# EasyEDA Pro project Motor_main.eprj

# Schematic MOTOR_MAIN_SCH
Board Name: MOTOR_MAIN_C8T6; Create Date: 2026-03-21; Page Name: P1; Project Name: Motor_main; Schematic Name: MOTOR_MAIN_SCH; Update Date: 2026-03-28; Company: EasyEDA.com; Drawn: DatPt; Page Size: A4; Version: V1.0
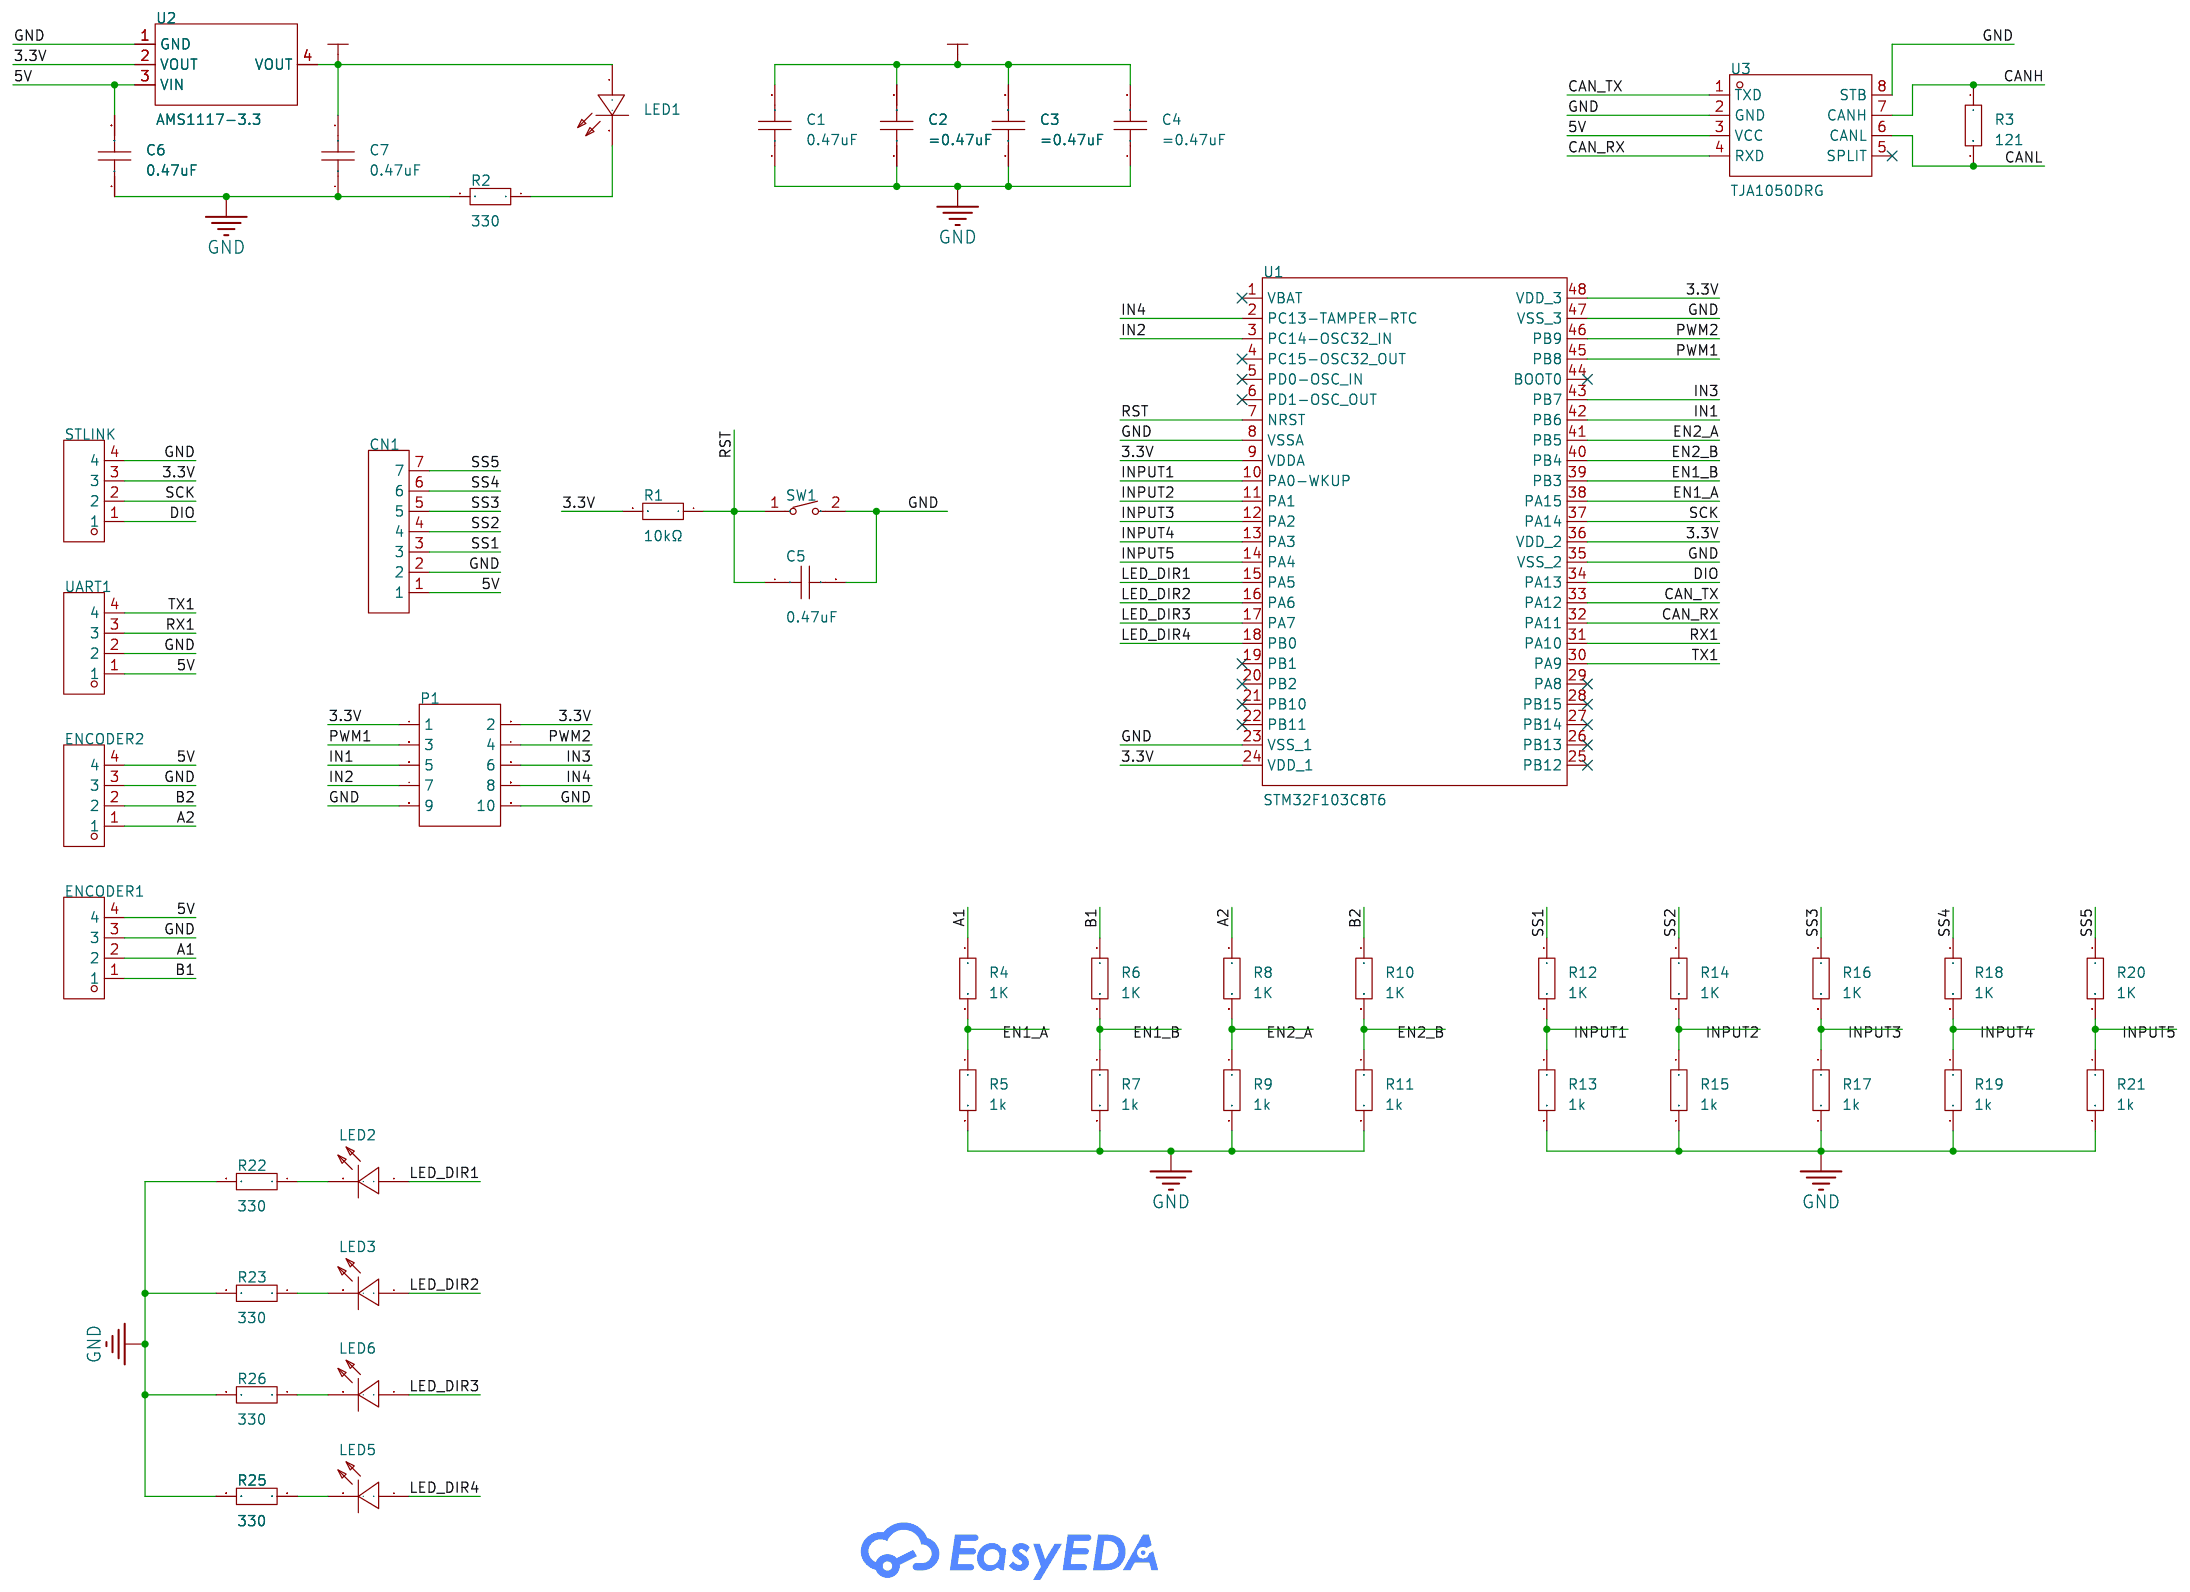
[diagram p0: schematic sheet]

## Parts
C1  0.47uF  [C0805]
C2  100nF  [C0805]
C3  100nF  [C0805]
C4  100nF  [C0805]
C5  0.47uF  [C0805]
C6  0.47uF  [C0805]
C7  0.47uF  [C0805]
CN1  WAFER-XH254Z-7AL  [CONN-TH_7P-P2.50_WAFER-XH254Z-7A]
ENCODER1  ZX-XH2.54-4PZZ  [CONN-TH_4P-P2.50_4PIN]
ENCODER2  ZX-XH2.54-4PZZ  [CONN-TH_4P-P2.50_4PIN]
LED1  YLED0805R  [LED0805-R-RD_RED]
LED2  YLED0805R  [LED0805-R-RD_RED]
LED3  YLED0805R  [LED0805-R-RD_RED]
LED5  YLED0805R  [LED0805-R-RD_RED]
LED6  YLED0805R  [LED0805-R-RD_RED]
P1  2.54-2*5P简牛  [IDC-TH_10P-P2.54_C5665]
R1  10kΩ  [R0805]
R2  10kΩ  [R0805]
R3  10kΩ  [R0805]
R4  1K  [R0805]
R5  1k  [R0805]
R6  1K  [R0805]
R7  1k  [R0805]
R8  1K  [R0805]
R9  1k  [R0805]
R10  1K  [R0805]
R11  1k  [R0805]
R12  1K  [R0805]
R13  1k  [R0805]
R14  1K  [R0805]
R15  1k  [R0805]
R16  1K  [R0805]
R17  1k  [R0805]
R18  1K  [R0805]
R19  1k  [R0805]
R20  1K  [R0805]
R21  1k  [R0805]
R22  10kΩ  [R0805]
R23  10kΩ  [R0805]
R25  10kΩ  [R0805]
R26  10kΩ  [R0805]
STLINK  ZX-XH2.54-4PZZ  [CONN-TH_4P-P2.50_4PIN]
SW1  GT-TC060A-H025-L1S  [SW-SMD_L6.1-W3.5-LS8.0]
U1  STM32F103C8T6  [LQFP-48_L7.0-W7.0-P0.50-LS9.0-BL]
U2  AMS1117-3.3  [SOT-223-3_L6.5-W3.4-P2.30-LS7.0-BR]
U3  TJA1050DRG  [SOP-8_L4.9-W3.9-P1.27-LS6.0-BL]
UART1  ZX-XH2.54-4PZZ  [CONN-TH_4P-P2.50_4PIN]

## Library data of the parts
C1-C7 = CC0805KRX7R9BB104: LCSC Part Name: 100nF ±10% 50V; Supplier Part: C49678; Manufacturer: YAGEO(国巨); Supplier Footprint: 0805; JLCPCB Part Class: Basic Part; Datasheet: https://item.szlcsc.com/datasheet/CC0805KRX7R9BB104/50686.html; Supplier: LCSC; Tolerance: ±10%; Voltage Rating: 50V; Temperature Coefficient: X7R
CN1 = WAFER-XH254Z-7AL: LCSC Part Name: 1x7P 间距:2.54mm 直插 系列:XH; Supplier Part: C22751800; Manufacturer: HANBO(汉博); Supplier Footprint: 插件,P=2.54mm; JLCPCB Part Class: Extended Part; Datasheet: https://item.szlcsc.com/datasheet/WAFER-XH254Z-7AL/24478735.html; Supplier: LCSC; Pins Structure: 1x7P; Pitch: 2.54mm; Mounting Type: Through Hole; Reference Series: XH; Number of Pins: 7P; Number of Rows: 1; Number of PINs Per Row: 7; Current Rating: 3A; Contact Material: Brass; Operating Temperature: -25℃~+85℃; Voltage Rating: 250V; Plastic Material: PA66; Flame Retardant Rating: UL94V-0
ENCODER1 ENCODER2 STLINK UART1 = ZX-XH2.54-4PZZ: LCSC Part Name: 1x4P 间距:2.5mm 直插 系列:XH; Supplier Part: C7429634; Manufacturer: Megastar(兆星); Supplier Footprint: 插件,P=2.5mm; JLCPCB Part Class: Extended Part; Datasheet: https://item.szlcsc.com/datasheet/ZX-XH2.54-4PZZ/8427551.html; Supplier: LCSC; Pins Structure: 1x4P; Pitch: 2.5mm; Mounting Type: Through Hole; Reference Series: XH; Number of Pins: 4P; Number of Rows: 1; Number of PINs Per Row: 4; Current Rating: 3A; Contact Material: Brass; Contact Plating: Tin; Operating Temperature: -25℃~+85℃; Voltage Rating: 250V; Plastic Material: PA66; Flame Retardant Rating: UL94V-0; Color: White; Z-Height of the Board: 7mm; X-Length of Bottom Edge on Board (Spacing Line): 12.5mm; Y-Width of Bottom Edge on Board: 5.9mm
LED1-LED3 LED5 LED6 = YLED0805R: Supplier Part: C19171391; Manufacturer: YONGYUTAI(永裕泰); Supplier Footprint: 0805; JLCPCB Part Class: Extended Part; Datasheet: https://atta.szlcsc.com/upload/public/pdf/source/20231027/AB486D22E6D71BC59190C48A798367E6.pdf; Supplier: LCSC; Emitted Color: Red; Forward Voltage (VF): 1.8V~2.4V; Power Dissipation: 60mW; Forward Current: 20mA; Dominant Wavelength: 615nm~630nm; Peak Wavelength: 645nm; Operating Temperature: -40℃~+85℃
P1 = 2.54-2*5P简牛: LCSC Part Name: 2.54mm 2x5P 排数:2 每排P数:5; Supplier Part: C5665; Manufacturer: BOOMELE(博穆精密); Supplier Footprint: 插件,P=2.54mm; JLCPCB Part Class: Extended Part; Datasheet: https://item.szlcsc.com/datasheet/2.54-2*5P%25E7%25AE%2580%25E7%2589%259B/6118.html; Supplier: LCSC; Connector Type: IDC Header; Pitch: 2.54mm; Number of Positions or Pins: 2x5P; Current Rating: 1A; Holder Type: Through Hole; Row Spacing: 2.54mm; Number of Rows: 2; Number of PINs Per Row: 5; Contact Material: Brass; Contact Plating: Gold; Operating Temperature: -55℃~+105℃; Color: Black
R1-R23 R25 R26 = RC0805FR-0710KL: LCSC Part Name: 厚膜电阻 10kΩ ±1% 125mW; Supplier Part: C84376; Manufacturer: YAGEO(国巨); Supplier Footprint: 0805; JLCPCB Part Class: Extended Part; Datasheet: https://item.szlcsc.com/datasheet/RC0805FR-0710KL/85546.html; Supplier: LCSC; Type: Thick Film Resistor; Tolerance: ±1%; Power(Watts): 125mW; Voltage-Supply(Max): 150V; Temperature Coefficient: ±100ppm/℃; Operating Temperature: -55℃~+155℃
SW1 = GT-TC060A-H025-L1S: LCSC Part Name: 3×6×2.5 立贴 无声轻触开关; Supplier Part: C7450623; Manufacturer: G-Switch(品赞); Supplier Footprint: SMD,3x6mm; JLCPCB Part Class: Extended Part; Datasheet: https://atta.szlcsc.com/upload/public/pdf/source/20230712/3FF422A4BEDB42853830040444FDF292.pdf; Supplier: LCSC; Circuit: SPST; Operating Force: 160gf; Mounting Style: Brick nogging; Strike Gundam: 不带; Contact Current: 50mA; Voltage Rating (AC): 12V; Voltage Rating (DC): 12V; Insulation Resistance: 100MΩ; With Lamp: No; Mechanical Life: 10万次
U1 = STM32F103C8T6: LCSC Part Name: 主流增强型ARM Cortex-M3 MCU，具有64 KB Flash、72 MHz CPU、电机控制、USB和CAN; Supplier Part: C8734; Manufacturer: ST(意法半导体); Supplier Footprint: LQFP-48(7x7); JLCPCB Part Class: Extended Part; Datasheet: https://item.szlcsc.com/datasheet/STM32F103C8T6/9243.html; Supplier: LCSC; CPU Core: ARM-M3; CPU Maximum Speed: 72MHz; Program Storage Size: 64KB; Program Memory Type: FLASH; Number of I/O: 37; ADC (Bit): 12bit; Voltage - Supply: 2V~3.6V
U2 = AMS1117-3.3_C6186: LCSC Part Name: 3.3V 1A 15V; Supplier Part: C6186; Manufacturer: AMS; Supplier Footprint: SOT-223; JLCPCB Part Class: Basic Part; Datasheet: https://item.szlcsc.com/datasheet/AMS1117-3.3/6652.html; Supplier: LCSC; Output Type: Fixed; Voltage - Supply: 15V; Output Voltage: 3.3V; Output Current: 1A; Power Supply Rejection Ratio (PSRR): 72dB@(120Hz); Voltage Dropout: 1.1V@(800mA); standby current: 5mA; Noise: 0.003%Vout; Features: Over Current Protection；Thermal Shutdown; Operating Temperature: -40℃~+125℃; Output Configuration: Positive; Number of Outputs: 1
U3 = TJA1050DRG: LCSC Part Name: 公预绝缘接头; Supplier Part: C19723770; Manufacturer: HGC(深圳汉芯); Supplier Footprint: SOP-8; JLCPCB Part Class: Extended Part; Datasheet: https://item.szlcsc.com/datasheet/TJA1050DRG/21040895.html; Supplier: LCSC; Type: CAN Transceiver; Data Rate: 1Mbps; Voltage - Supply: 4.75V~5.25V; Current - Supply: 70mA; Operating Temperature: -40℃~+150℃; Quiescent Supply Current: 15uA

## Nets
3.3V: C1.2 C2.2 C3.2 C4.2 C7.2 LED1.1(+) P1.1 P1.2 R1.2 STLINK.3 U1.9(VDDA) U1.24(VDD_1) U1.36(VDD_2) U1.48(VDD_3) U2.2(VOUT) U2.4(VOUT)
5V: C6.2 CN1.1 ENCODER1.4 ENCODER2.4 U2.3(VIN) U3.3(VCC) UART1.1
GND: C1.1 C2.1 C3.1 C4.1 C5.2 C6.1 C7.1 CN1.2 ENCODER1.3 ENCODER2.3 P1.9 P1.10 R2.2 R5.2 R7.2 R9.2 R11.2 R13.2 R15.2 R17.2 R19.2 R21.2 R22.2 R23.2 R25.2 R26.2 STLINK.4 SW1.2 U1.8(VSSA) U1.23(VSS_1) U1.35(VSS_2) U1.47(VSS_3) U2.1(GND) U3.2(GND) U3.8(STB) UART1.2
A1: ENCODER1.2 R4.1
A2: ENCODER2.1 R8.1
B1: ENCODER1.1 R6.1
B2: ENCODER2.2 R10.1
CAN_RX: U1.32(PA11) U3.4(RXD)
CAN_TX: U1.33(PA12) U3.1(TXD)
CANH: R3.1 U3.7(CANH)
CANL: R3.2 U3.6(CANL)
DIO: STLINK.1 U1.34(PA13)
EN1_A: R4.2 R5.1 U1.38(PA15)
EN1_B: R6.2 R7.1 U1.39(PB3)
EN2_A: R8.2 R9.1 U1.41(PB5)
EN2_B: R10.2 R11.1 U1.40(PB4)
IN1: P1.5 U1.42(PB6)
IN2: P1.7 U1.3(PC14-OSC32_IN)
IN3: P1.6 U1.43(PB7)
IN4: P1.8 U1.2(PC13-TAMPER-RTC)
INPUT1: R12.2 R13.1 U1.10(PA0-WKUP)
INPUT2: R14.2 R15.1 U1.11(PA1)
INPUT3: R16.2 R17.1 U1.12(PA2)
INPUT4: R18.2 R19.1 U1.13(PA3)
INPUT5: R20.2 R21.1 U1.14(PA4)
LED_DIR1: LED2.1(+) U1.15(PA5)
LED_DIR2: LED3.1(+) U1.16(PA6)
LED_DIR3: LED6.1(+) U1.17(PA7)
LED_DIR4: LED5.1(+) U1.18(PB0)
PWM1: P1.3 U1.45(PB8)
PWM2: P1.4 U1.46(PB9)
RST: C5.1 R1.1 SW1.1 U1.7(NRST)
RX1: U1.31(PA10) UART1.3
SCK: STLINK.2 U1.37(PA14)
SS1: CN1.3 R12.1
SS2: CN1.4 R14.1
SS3: CN1.5 R16.1
SS4: CN1.6 R18.1
SS5: CN1.7 R20.1
TX1: U1.30(PA9) UART1.4
$1N1653: LED1.2(-) R2.1
$1N4594: LED2.2(-) R22.1
$1N4722: LED3.2(-) R23.1
$1N4920: LED5.2(-) R25.1
$1N5019: LED6.2(-) R26.1

Not connected (* = marked no-connect by the designer): U1 1(VBAT)* 4(PC15-OSC32_OUT)* 5(PD0-OSC_IN)* 6(PD1-OSC_OUT)* 19(PB1)* 20(PB2)* 21(PB10)* 22(PB11)* 25(PB12)* 26(PB13)* 27(PB14)* 28(PB15)* 29(PA8)* 44(BOOT0)*; U3 5(SPLIT)*

# Board MOTOR_MAIN_PCB
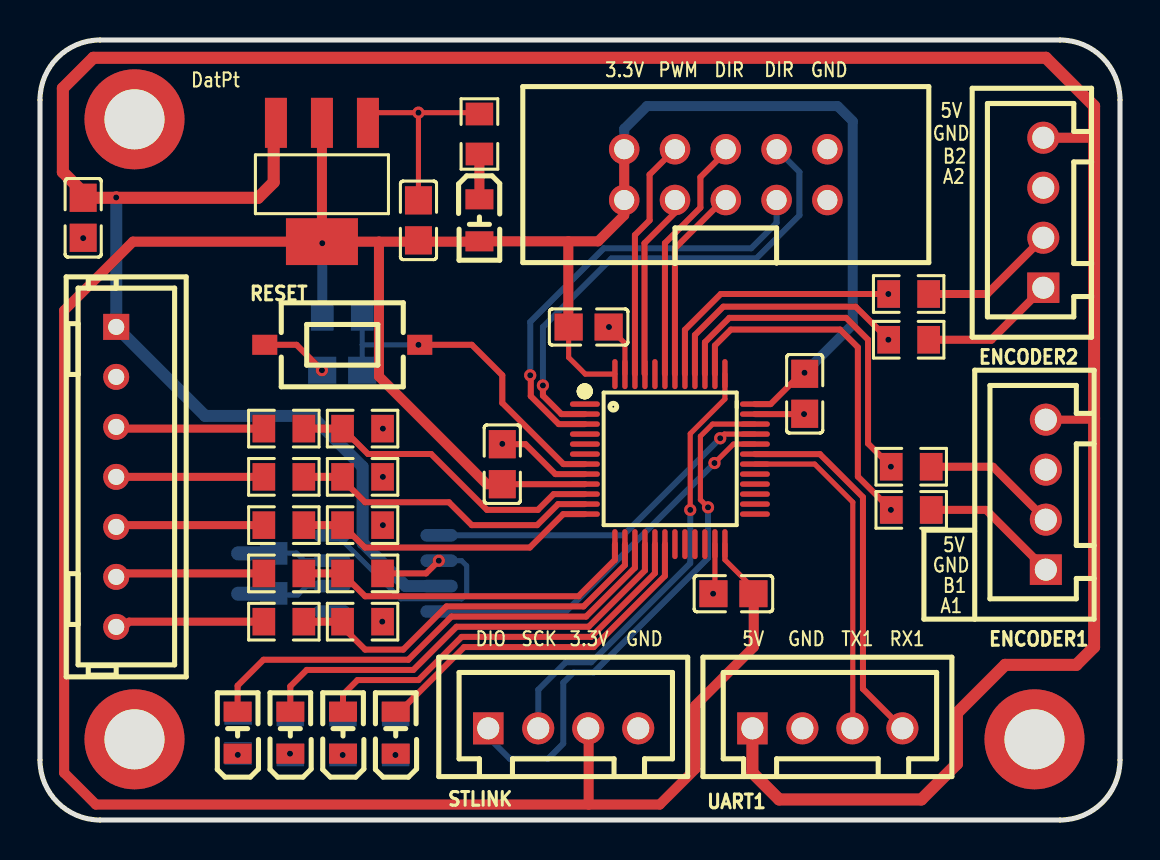
[diagram p1: board, top side]
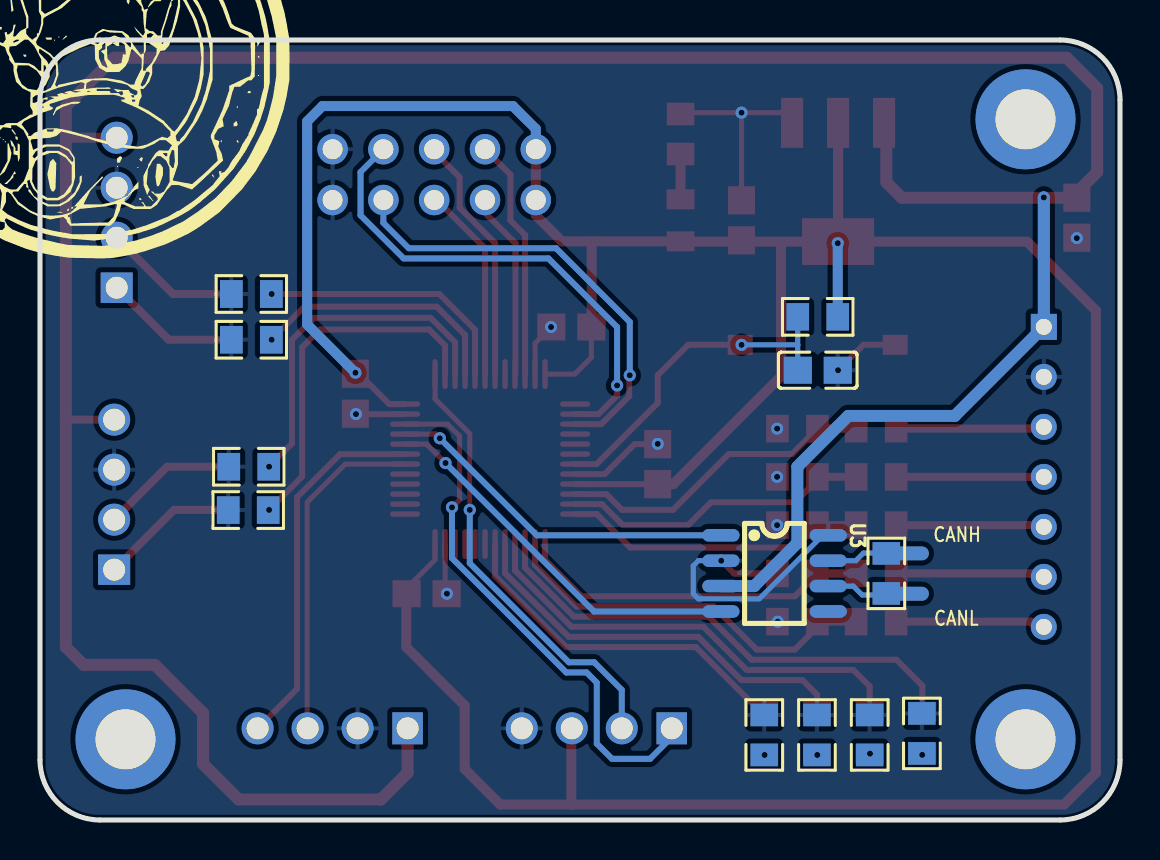
[diagram p2: board, bottom side, seen from below]

Outline 54 x 39 mm; copper layers: Top Layer, Bottom Layer. Coordinates in mm from the lower left corner of the outline.
Outline path: 0,36 0,3 arc(0.88,0.88) 3,0 51,0 arc(53.12,0.88) 54,3 54,36 arc(53.12,38.12) 51,39 3,39 arc(0.88,38.12) 0,36
Stack: Top Layer 0.035mm / Dielectric1 1.51mm FR4 er 4.5 / Bottom Layer 0.035mm

## Design rules (mm)
template: JLCPCB Capability(Two Layers Board)
spacing copperThickness1oz (default): track to track 0.102, other pairs 0.152 to 0.3
spacing copperThickness2oz: track to track 0.203, other pairs 0.152 to 0.3
track width copperThickness1oz (default): min 0.127, default 0.254, max 2.54
track width copperThickness2oz: min 0.203, default 0.254, max 2.54
differential pair differentialPair (default): width min 0.127, default 0.254, max 2.54; gap min 0.152, default 0.152
via viaSize (default): diameter min 0.5, default 0.61, max 10; hole min 0.3, default 0.305, max 6.3

## Placement (name value [footprint] x y rotation side)
C1  0.47uF  [C0805]  27.43 24.65 180 top
C2  100nF  [C0805]  38.23 21.31 90 top
C3  100nF  [C0805]  23.11 17.79 270 top
C4  100nF  [C0805]  34.67 11.31 0 top
C5  0.47uF  [C0805]  15.11 22.49 180 bottom
C6  0.47uF  [C0805]  2.16 30.11 90 top
C7  0.47uF  [C0805]  18.92 29.98 270 top
CN1  WAFER-XH254Z-7AL  [CONN-TH_7P-P2.50_WAFER-XH254Z-7A]  3.81 17.16 270 top
ENCODER1  ZX-XH2.54-4PZZ  [CONN-TH_4P-P2.50_4PIN]  50.29 16.27 90 top
ENCODER2  ZX-XH2.54-4PZZ  [CONN-TH_4P-P2.50_4PIN]  50.17 30.36 90 top
LED1  YLED0805R  [LED0805-R-RD_RED]  21.97 29.98 270 top
LED2  YLED0805R  [LED0805-R-RD_RED]  9.88 4.37 90 top
LED3  YLED0805R  [LED0805-R-RD_RED]  12.52 4.37 90 top
LED5  YLED0805R  [LED0805-R-RD_RED]  17.79 4.37 90 top
LED6  YLED0805R  [LED0805-R-RD_RED]  15.15 4.37 90 top
NOREF  -  [Pad_e55]  4.73 35.03 0 top
NOREF#2  -  [Pad_e66]  4.73 4.03 0 top
NOREF#3  -  [Pad_e67]  49.73 4.03 0 top
P1  2.54-2*5P简牛  [IDC-TH_10P-P2.54_C5665]  34.29 32.27 0 top
R1  10kΩ  [R0805]  15.11 25.16 180 bottom
R2  10kΩ  [R0805]  21.97 34.3 90 top
R3  10kΩ  [R0805]  11.68 12.33 270 bottom
R4  1K  [R0805]  43.56 15.5 180 top
R5  1k  [R0805]  43.59 15.5 0 bottom
R6  1K  [R0805]  43.56 17.66 180 top
R7  1k  [R0805]  43.56 17.66 0 bottom
R8  1K  [R0805]  43.43 26.3 180 top
R9  1k  [R0805]  43.43 26.3 0 bottom
R10  1K  [R0805]  43.43 24.01 180 top
R11  1k  [R0805]  43.43 24.01 0 bottom
R12  1K  [R0805]  12.19 19.57 0 top
R13  1k  [R0805]  16.13 19.57 0 top
R14  1K  [R0805]  12.19 17.16 0 top
R15  1k  [R0805]  16.13 17.16 0 top
R16  1K  [R0805]  12.19 14.74 0 top
R17  1k  [R0805]  16.13 14.74 0 top
R18  1K  [R0805]  12.19 12.33 0 top
R19  1k  [R0805]  16.13 12.33 0 top
R20  1K  [R0805]  12.19 9.92 0 top
R21  1k  [R0805]  16.13 9.92 0 top
R22  10kΩ  [R0805]  9.91 4.33 90 bottom
R23  10kΩ  [R0805]  12.52 4.25 90 bottom
R25  10kΩ  [R0805]  17.79 4.25 90 bottom
R26  10kΩ  [R0805]  15.15 4.25 90 bottom
RESET  GT-TC060A-H025-L1S  [SW-SMD_L6.1-W3.5-LS8.0]  15.11 23.76 180 top
STLINK  ZX-XH2.54-4PZZ  [CONN-TH_4P-P2.50_4PIN]  26.16 4.58 0 top
U1  STM32F103C8T6  [LQFP-48_L7.0-W7.0-P0.50-LS9.0-BL]  31.5 18.05 270 top
U2  AMS1117-3.3  [SOT-223-3_L6.5-W3.4-P2.30-LS7.0-BR]  14.1 31.89 90 top
U3  TJA1050DRG  [SOP-8_L4.9-W3.9-P1.27-LS6.0-BL]  17.27 12.33 270 bottom
UART1  ZX-XH2.54-4PZZ  [CONN-TH_4P-P2.50_4PIN]  39.37 4.58 0 top

## Footprints (pads in the part's own frame, mm; a bottom-side part is the same pattern mirrored in y, then rotated)
C0805
  rect 1.41x1.35 smd: 1(-1,0) 2(1,0)
CONN-TH_4P-P2.50_4PIN
  rect 1.524x1.6 hole 1.1: 1(-3.75,0)
  round 1.6 hole 1.1: 2(-1.25,0) 3(1.25,0) 4(3.75,0)
CONN-TH_7P-P2.50_WAFER-XH254Z-7A
  rect 1.3x1.3 hole 0.8: 1(-7.5,0)
  round 1.3 hole 0.8: 2(-5,0) 3(-2.5,0) 4(0,0) 5(2.5,0) 6(5,0) 7(7.5,0)
IDC-TH_10P-P2.54_C5665
  round 1.524 hole 1: 1(-5.08,-1.27) 2(-5.08,1.27) 3(-2.54,-1.27) 4(-2.54,1.27) 5(0,-1.27) 6(0,1.27) 7(2.54,-1.27) 8(2.54,1.27) 9(5.08,-1.27) 10(5.08,1.27)
LED0805-R-RD_RED
  rect 1x1.399 smd: 1(1.05,0) 2(-1.05,0)
LQFP-48_L7.0-W7.0-P0.50-LS9.0-BL
  oval 0.27x1.5 smd: 1(-2.75,-4.25) 2(-2.25,-4.25) 3(-1.75,-4.25) 4(-1.25,-4.25) 5(-0.75,-4.25) 6(-0.25,-4.25) 7(0.25,-4.25) 8(0.75,-4.25) 9(1.25,-4.25) 10(1.75,-4.25) 11(2.25,-4.25) 12(2.75,-4.25) 25(2.75,4.25) 26(2.25,4.25) 27(1.75,4.25) 28(1.25,4.25) 29(0.75,4.25) 30(0.25,4.25) 31(-0.25,4.25) 32(-0.75,4.25) 33(-1.25,4.25) 34(-1.75,4.25) 35(-2.25,4.25) 36(-2.75,4.25)
  oval 1.5x0.27 smd: 13(4.25,-2.75) 14(4.25,-2.25) 15(4.25,-1.75) 16(4.25,-1.25) 17(4.25,-0.75) 18(4.25,-0.25) 19(4.25,0.25) 20(4.25,0.75) 21(4.25,1.25) 22(4.25,1.75) 23(4.25,2.25) 24(4.25,2.75) 37(-4.25,2.75) 38(-4.25,2.25) 39(-4.25,1.75) 40(-4.25,1.25) 41(-4.25,0.75) 42(-4.25,0.25) 43(-4.25,-0.25) 44(-4.25,-0.75) 45(-4.25,-1.25) 46(-4.25,-1.75) 47(-4.25,-2.25) 48(-4.25,-2.75)
Pad_e55
  round 5 hole 3: 65(0,0)
Pad_e66
  round 5 hole 3: 65(0,0)
Pad_e67
  round 5 hole 3: 65(0,0)
R0805
  rect 1.133x1.377 smd: 1(-1,0) 2(1,0)
SOP-8_L4.9-W3.9-P1.27-LS6.0-BL
  oval 0.63x1.865 smd: 1(-1.905,-2.683) 2(-0.635,-2.683) 3(0.635,-2.683) 4(1.905,-2.683) 5(1.905,2.683) 6(0.635,2.683) 7(-0.635,2.683) 8(-1.905,2.683)
SOT-223-3_L6.5-W3.4-P2.30-LS7.0-BR
  rect 2.5x1.1 smd: 1(2.97,-2.3) 2(2.97,0) 3(2.97,2.3)
  rect 2.34x3.6 smd: 4(-2.97,0)
SW-SMD_L6.1-W3.5-LS8.0
  rect 1.25x1 smd: 1(-3.875,0) 2(3.875,0)

## Nets
As in the schematic, except:
GND: C1.1 C2.1 C3.1 C4.1 C5.2 C6.1 C7.1 CN1.2 ENCODER1.3 ENCODER2.3 P1.9 P1.10 R2.2 R5.2 R7.2 R9.2 R11.2 R13.2 R15.2 R17.2 R19.2 R21.2 R22.2 R23.2 R25.2 R26.2 RESET.2 STLINK.4 U1.8 U1.23 U1.35 U1.47 U2.1 U3.2 U3.8 UART1.2
A1: ENCODER1.1 R4.1
A2: ENCODER2.2 R8.1
B1: ENCODER1.2 R6.1
B2: ENCODER2.1 R10.1
RST: C5.1 R1.1 RESET.1 U1.7
RX1: U1.31 UART1.4
TX1: U1.30 UART1.3

Pads without a net: NOREF 65; NOREF#2 65; NOREF#3 65; U1 1 4 5 6 19 20 21 22 25 26 27 28 29 44; U3 5

## Via types
v1: diameter 0.61, hole 0.305, Top Layer to Bottom Layer, 30 vias

## Routing (per net, layer and track width the routed paths; a pad name or vN(x,y) marks a point on that pad's centre or on a via; arc(x,y) is an arc through that point)
3.3V: length 173.5
  Top Layer w0.254: C4.2 35.67,11.58 34.25,13.01 U1.24 ; C1.2 26.43,23.12 27.26,22.3 U1.48
  Top Layer w0.3: C3.2 27.24,16.79 U1.9 ; U1.36 36.53,20.8 38.05,22.31 C2.2
  Top Layer w0.5: 26.42,28.93 26.42,24.66 C1.2 ; 26.42,28.93 LED1.1 21.96,28.92 16.95,28.92 ; 26.42,28.93 27.91,28.93 29.21,30.24 P1.2 ; U2.2 U2.4 ; U2.4 16.95,28.92 ; U2.4 4.65,28.92 1.21,25.47 1.21,2.36 2.79,0.77 27.43,0.77 ; 16.95,28.92 16.95,22.18 22.34,16.79 C3.2 ; C4.2 35.69,11.3 35.69,8.65 32.77,5.73 32.77,2.55 30.99,0.77 27.43,0.77 ; 27.43,0.77 27.43,4.56 STLINK.3
  Bottom Layer w0.5: P1.2 29.21,34.55 30.35,35.7 39.88,35.7 40.64,34.94 40.64,24.78 v1(38.23,22.36) ; R1.2 v1(14.11,28.84)
5V: length 158.6
  Top Layer w0.4: 52.7,20.07 52.65,20.02 ENCODER1.4
  Top Layer w0.5: ENCODER2.4 52.66,34.11
  Top Layer w0.6: UART1.1 35.62,2.36 36.96,1.03 44.07,1.03 45.85,2.8 45.85,5.34 48.26,7.76 51.82,7.76 52.7,8.65 52.7,35.7 50.29,38.11 2.67,38.11 1.14,36.59 1.14,32.4 2.16,31.38 C6.2 10.91,31.11 11.68,31.89 11.68,34.74 U2.3
  Bottom Layer w0.6: U3.3 18.29,11.69 16.13,13.85 16.13,17.66 13.59,20.2 8.26,20.2 CN1.1 v1(3.81,31.13)
GND: length 40.3
  Top Layer w0.254: v1(18.92,35.37) 16.91,35.37 U2.1 ; v1(18.92,35.37) C7.1 ; v1(18.92,35.37) 21.91,35.37 21.97,35.43 ; C3.1 v1(23.11,18.81) ; v1(28.45,24.65) C1.1 29.25,23.83 U1.47 ; R13.2 v1(17.14,19.57) ; U1.23 33.75,11.39 C4.1 ; C6.1 v1(2.16,29.09) ; R15.2 v1(17.14,17.16) ; R17.2 v1(17.14,14.74)
  Top Layer w0.3: U1.8 25.77,17.3 24.27,18.79 C3.1 ; v1(19.94,12.96) 19.3,12.33 R19.2 ; C2.1 38.22,20.3 U1.35 ; v1(14.1,22.49) 12.83,23.76 RESET.2
  Bottom Layer w0.254: v1(19.94,12.96) 21.08,12.96 21.34,12.71 21.34,11.31 21.08,11.06 18.03,11.06 14.86,14.23 U3.8
  vias: v1(17.11,9.92) v1(33.66,11.31) v1(38.2,20.3)
A1: length 7
  Top Layer w0.4: ENCODER1.1 47.3,15.5 R4.1
A2: length 6.9
  Top Layer w0.4: R8.1 47.35,26.3 ENCODER2.2
B1: length 6.8
  Top Layer w0.4: R6.1 47.64,17.66 ENCODER1.2
B2: length 6.8
  Top Layer w0.4: R10.1 47.57,24.01 ENCODER2.1
CAN_RX: length 19.3
  Top Layer w0.254: v1(33.72,17.85) 34.67,18.8 U1.32
  Bottom Layer w0.3: U3.4 26.3,10.42 v1(33.72,17.85)
CAN_TX: length 17.9
  Top Layer w0.254: v1(34.01,19.09) 34.22,19.3 U1.33
  Bottom Layer w0.3: U3.1 29.16,14.23 v1(34.01,19.09)
CANH: length 4.8
  Bottom Layer w0.254: U3.7 13.21,12.96 12.83,13.35 11.7,13.35 R3.1
  Bottom Layer w0.7: R3.1 9.91,13.33
CANL: length 4.9
  Bottom Layer w0.254: R3.2 11.76,11.25 12.89,11.25 13.33,11.69 U3.6
  Bottom Layer w0.7: 9.91,11.31 11.67,11.31 R3.2
DIO: length 27.1
  Top Layer w0.254: U1.34 33.63,19.8 33.02,19.19 33.02,16.01 v1(33.4,15.63)
  Bottom Layer w0.3: v1(33.4,15.63) 33.4,13.09 27.69,7.38 26.67,7.38 26.16,6.87 26.16,3.82 25.4,3.06 23.5,3.06 22.41,4.14 STLINK.1
EN1_A: length 18.1
  Top Layer w0.3: U1.38 33.75,23.72 34.54,24.52 40.01,24.52 40.89,23.63 40.89,17.17 R4.2
  vias: v1(42.55,15.5)
EN1_B: length 17.5
  Top Layer w0.3: R6.2 41.4,18.82 41.4,24.01 40.31,25.11 34.47,25.11 33.25,23.89 U1.39
  vias: v1(42.55,17.66)
EN2_A: length 13.1
  Top Layer w0.3: R8.2 34.04,26.3 32.25,24.51 U1.41
  vias: v1(42.42,26.3)
EN2_B: length 12.9
  Top Layer w0.3: U1.40 32.75,24.25 34.16,25.66 40.78,25.66 R10.2
  vias: v1(42.42,24.01)
IN1: length 9.8
  Top Layer w0.3: P1.5 34.16,31 31.75,28.58 U1.42
IN2: length 22.5
  Top Layer w0.3: U1.3 25.94,19.8 24.54,21.19 24.54,22.21 v1(24.51,22.24)
  Bottom Layer w0.3: P1.7 36.83,29.86 35.56,28.59 28.19,28.59 24.51,24.9 v1(24.51,22.24)
IN3: length 12.5
  Top Layer w0.3: P1.6 34.29,33.41 33.02,32.14 33.02,30.62 31.25,28.84 U1.43
IN4: length 24.8
  Top Layer w0.3: v1(25.15,21.73) 25.15,21.22 26.07,20.3 U1.2
  Bottom Layer w0.3: v1(25.15,21.73) 25.15,24.65 28.58,28.08 35.81,28.08 37.97,30.24 37.97,32.4 P1.8
INPUT1: length 16.1
  Top Layer w0.3: U1.10 25.68,16.3 24.89,15.5 22.35,15.5 19.56,18.3 16.4,18.3 R13.1
  Top Layer w0.4: R12.2 R13.1
INPUT2: length 15.6
  Top Layer w0.3: U1.11 25.91,15.8 24.86,14.74 21.59,14.74 20.45,15.89 16.26,15.89 15.13,17.01 R15.1
  Top Layer w0.4: R14.2 R15.1
INPUT3: length 15.2
  Top Layer w0.3: U1.12 26.16,15.3 24.49,13.62 16.25,13.62 R17.1
  Top Layer w0.4: R16.2 R17.1
INPUT4: length 17.6
  Top Layer w0.3: R19.1 15.13,12.31 16.26,11.19 26.92,11.19 28.75,13.01 U1.13
  Top Layer w0.4: R18.2 R19.1
INPUT5: length 19.6
  Top Layer w0.3: R21.1 15.13,9.65 16.26,8.52 18.16,8.52 20.32,10.68 27.18,10.68 29.25,12.75 U1.14
  Top Layer w0.4: R20.2 R21.1
LED_DIR1: length 24.8
  Top Layer w0.3: LED2.1 9.88,6.72 11.18,8.01 18.42,8.01 20.57,10.17 27.3,10.17 29.75,12.61 U1.15
LED_DIR2: length 22.7
  Top Layer w0.3: LED3.1 12.52,6.69 13.33,7.5 18.67,7.5 20.83,9.66 27.43,9.66 30.25,12.48 U1.16
LED_DIR3: length 20.4
  Top Layer w0.3: LED6.1 15.15,6.27 15.88,7 18.92,7 21.08,9.16 27.56,9.16 30.75,12.34 U1.17
LED_DIR4: length 17.9
  Top Layer w0.3: U1.18 31.25,12.21 27.69,8.65 21.21,8.65 17.98,5.42 LED5.1
PWM1: length 9.3
  Top Layer w0.254: U1.45 30.23,22.31 ; 31.75,30.36 P1.3
  Top Layer w0.3: 30.23,22.31 30.23,28.84 31.75,30.36
PWM2: length 12.1
  Top Layer w0.3: P1.4 30.48,32.27 30.48,29.98 29.75,29.25 U1.46
RST: length 17
  Top Layer w0.3: RESET.1 21.59,23.76 23.11,22.24 23.11,20.85 26.17,17.8 U1.7
  Bottom Layer w0.254: 16.11,23.76 C5.1 ; 16.11,23.76 R1.1 ; 16.11,23.76 v1(18.92,23.76)
RX1: length 18.7
  Top Layer w0.3: U1.31 38.99,18.3 41.15,16.14 41.15,6.55 UART1.4
SCK: length 22.3
  Top Layer w0.254: U1.37 34.25,21.05 32.51,19.31 v1(32.51,15.5)
  Bottom Layer w0.3: v1(32.51,15.5) 32.51,12.84 27.56,7.88 26.29,7.88 24.91,6.51 STLINK.2
SS1: length 7.5
  Top Layer w0.4: 3.81,19.27 4.1,19.57 R12.1
SS2: length 7.5
  Top Layer w0.4: 3.81,16.77 4.19,17.16 R14.1
SS3: length 7.6
  Top Layer w0.4: 3.81,14.27 4.28,14.74 R16.1
SS4: length 7.6
  Top Layer w0.4: R18.1 4.37,12.33 3.81,11.77
SS5: length 7.6
  Top Layer w0.4: 3.81,9.27 4.45,9.92 R20.1
TX1: length 17
  Top Layer w0.254: UART1.3 40.64,4.6 40.64,15.89 38.73,17.8 U1.30
$1N1653: length 2.4
  Top Layer w0.5: LED1.2 21.97,33.43
$1N4594:
  vias: v1(9.89,3.26)
$1N4722:
  vias: v1(12.5,3.32)
$1N4920:
  vias: v1(17.77,3.25)
$1N5019:
  vias: v1(15.14,3.25)

## Copper pours and planes (outline as drawn; the poured copper is in the pictures)
GND on Bottom Layer: 0.25,38.75 53.72,38.75 53.72,0.27 0.25,0.27

## Text on the board
Bottom Silkscreen Layer: CANL | CANH
Top Silkscreen Layer: DatPt | DIO | SCK | 3.3V | GND | PWM | DIR | 5V | TX1 | RX1 | A1 | B2 | A2 | B1
